# Altium project Balance-car.PrjPcb
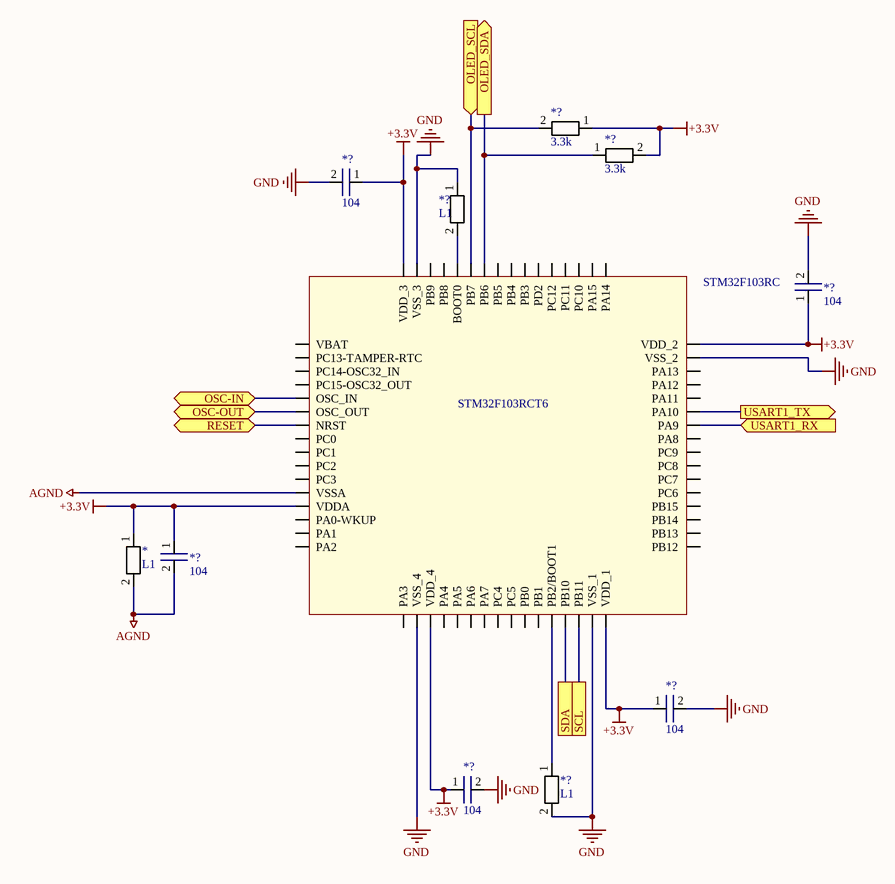
[diagram p0: MCU-system.SchDoc]
4 sheets, 35 parts. Net scope: flat (ports and power ports of the same name join across sheets).
Sheets:
  MCU-system.SchDoc
  POWER.SchDoc
  MPU6050.SchDoc
  HW.SchDoc

## Sheet MCU-system.SchDoc
size A4

### Parts
(Parts that share a designator on the sheet are numbered #1, #2 ... from top to bottom, then left to right.)
*#1  L1  [R_SMD_0603]
*?#1  3.3k  [R_SMD_0603]
*?#2  3.3k  [R_SMD_0603]
*?#3  104  [C_SOP_0603]
*?#4  L1  [R_SMD_0603]
*?#5  104  [C_SOP_0603]
*?#6  104  [C_SOP_0603]
*?#7  104  [C_SOP_0603]
*?#8  104  [C_SOP_0603]
*?#9  L1  [R_SMD_0603]
?  STM32F103RC  [LQFP_64_10X10]

### Ports
OLED_SCL (in), OLED_SDA (out), OSC-IN (bidir), OSC-OUT (bidir), RESET (bidir), SCL, SDA, USART1_RX (in), USART1_TX (out)

### Nets
+3.3V: *#1.1 *?#1.1 *?#2.2 *?#3.1 *?#5.1 *?#6.1 *?#7.1 *?#8.1 ?.13(VDDA) ?.19(VDD_4) ?.32(VDD_1) ?.48(VDD_2) ?.64(VDD_3)
AGND: *#1.2 *?#6.2 ?.12(VSSA)
GND: *?#3.2 *?#4.1 *?#5.2 *?#7.2 *?#8.2 *?#9.2 ?.18(VSS_4) ?.31(VSS_1) ?.47(VSS_2) ?.63(VSS_3)
Net*?#1_2: *?#1.2 ?.59(PB7) ; port OLED_SCL
Net*?#2_1: *?#2.1 ?.58(PB6) ; port OLED_SDA
Net*?#4_2: *?#4.2 ?.60(BOOT0)
Net*?#9_1: *?#9.1 ?.28(PB2/BOOT1)
Net?_5: ?.5(OSC_IN) ; port OSC-IN
Net?_6: ?.6(OSC_OUT) ; port OSC-OUT
Net?_7: ?.7(NRST) ; port RESET
Net?_29: ?.29(PB10) ; port SDA
Net?_30: ?.30(PB11) ; port SCL
Net?_42: ?.42(PA9) ; port USART1_RX
Net?_43: ?.43(PA10) ; port USART1_TX

Not connected (* = marked no-connect by the designer): ? 1(VBAT) 2(PC13-TAMPER-RTC) 3(PC14-OSC32_IN) 4(PC15-OSC32_OUT) 8(PC0) 9(PC1) 10(PC2) 11(PC3) 14(PA0-WKUP) 15(PA1) 16(PA2) 17(PA3) 20(PA4) 21(PA5) 22(PA6) 23(PA7) 24(PC4) 25(PC5) 26(PB0) 27(PB1) 33(PB12) 34(PB13) 35(PB14) 36(PB15) 37(PC6) 38(PC7) 39(PC8) 40(PC9) 41(PA8) 44(PA11) 45(PA12) 46(PA13) 49(PA14) 50(PA15) 51(PC10) 52(PC11) 53(PC12) 54(PD2) 55(PB3) 56(PB4) 57(PB5) 61(PB8) 62(PB9)

### Notes on the sheet
- (in symbol STM32F103RC) STM32F103RCT6

### Library data of the parts
*#1 *?#1 *?#2 *?#4 *?#9 = R_SMD
*?#3 *?#5-*?#8 = C_SMD

## Sheet POWER.SchDoc
size A4
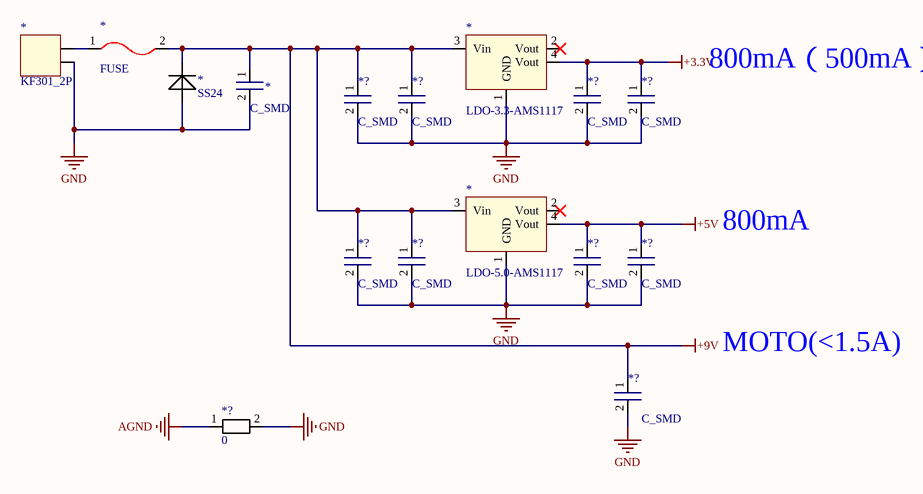
[diagram p1: POWER.SchDoc]

### Parts
(Parts that share a designator on the sheet are numbered #1, #2 ... from top to bottom, then left to right.)
*#2  KF301_2P  [KF301_2P]
*#3  FUSE  [Fuse_0805]
*#4  LDO-3.3-AMS1117  [SOT223_3]
*#5  SS24  [LC-SMA(DO-214AC)_S5]
*#6  C_SMD  [C_SOP_0603]
*#7  LDO-5.0-AMS1117  [SOT223_3]
*?#10  C_SMD  [C_SOP_0603]
*?#11  C_SMD  [C_SOP_0603]
*?#12  C_SMD  [C_SOP_0603]
*?#13  C_SMD  [C_SOP_0603]
*?#14  C_SMD  [C_SOP_0603]
*?#15  C_SMD  [C_SOP_0603]
*?#16  C_SMD  [C_SOP_0603]
*?#17  C_SMD  [C_SOP_0603]
*?#18  C_SMD  [C_SOP_0603]
*?#19  0  [R_SMD_0603]

### Nets
+3.3V: *#4.4(Vout) *?#12.1 *?#13.1
+5V: *#7.4(Vout) *?#16.1 *?#17.1
+9V: *#3.2(OUT) *#4.3(Vin) *#5.2 *#6.1 *#7.3(Vin) *?#10.1 *?#11.1 *?#14.1 *?#15.1 *?#18.1
AGND: *?#19.1
GND: *#2.2(GND) *#4.1(GND) *#5.1 *#6.2 *#7.1(GND) *?#10.2 *?#11.2 *?#12.2 *?#13.2 *?#14.2 *?#15.2 *?#16.2 *?#17.2 *?#18.2 *?#19.2
Net*#2_1: *#2.1(VCC) *#3.1(OUT)

Not connected (* = marked no-connect by the designer): *#4 2(Vout)*; *#7 2(Vout)*

### Notes on the sheet
- 800mA（500mA）
- 800mA
- MOTO(<1.5A)

### Library data of the parts
*#2 = 接线端子
*?#19 = R_SMD

## Sheet MPU6050.SchDoc
size A4

## Sheet HW.SchDoc
size A4
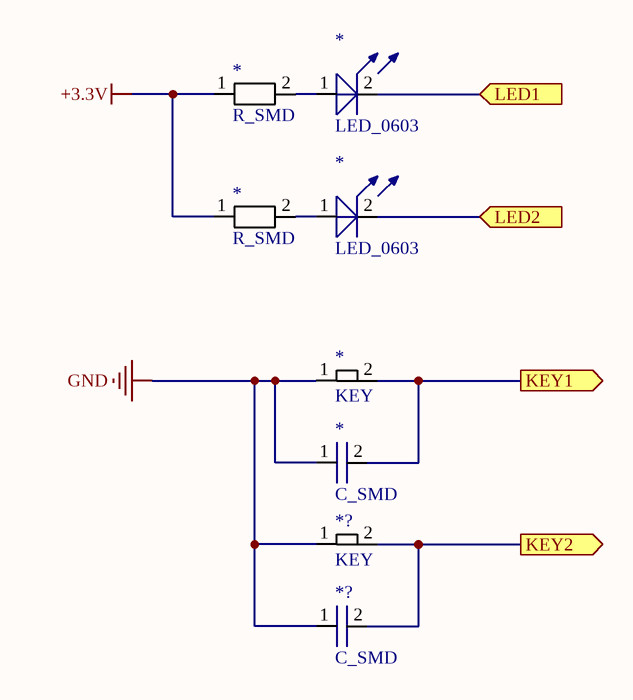
[diagram p2: HW.SchDoc]

### Parts
(Parts that share a designator on the sheet are numbered #1, #2 ... from top to bottom, then left to right.)
*#8  R_SMD  [R_SMD_0603]
*#9  LED_0603  [LED_0603_B]
*#10  R_SMD  [R_SMD_0603]
*#11  LED_0603  [LED_0603_B]
*#12  KEY  [SW_PB_3X6]
*#13  C_SMD  [C_SOP_0603]
*?#20  KEY  [SW_PB_3X6]
*?#21  C_SMD  [C_SOP_0603]

### Ports
KEY1 (out), KEY2 (out), LED1 (in), LED2 (in)

### Nets
+3.3V: *#8.1 *#10.1
GND: *#12.1 *#13.1 *?#20.1 *?#21.1
Net*#8_2: *#8.2 *#9.1
Net*#9_2: *#9.2 ; port LED1
Net*#10_2: *#10.2 *#11.1
Net*#11_2: *#11.2 ; port LED2
Net*#12_2: *#12.2 *#13.2 ; port KEY1
Net*?#20_2: *?#20.2 *?#21.2 ; port KEY2

## Nets that join several sheets
+3.3V: MCU-system (13 pins), POWER (*#4.4 *?#12.1 *?#13.1), HW (*#8.1 *#10.1)
AGND: MCU-system (*#1.2 *?#6.2 ?.12), POWER (*?#19.1)
GND: MCU-system (10 pins), POWER (15 pins), HW (*#12.1 *#13.1 *?#20.1 *?#21.1)